# Altium schematic sheet ESP.SchDoc: Lab. Proj. PCB
size A4; Author: Tomasz Machnik; Revision: 1; SheetNumber: 4; SheetTotal: 7
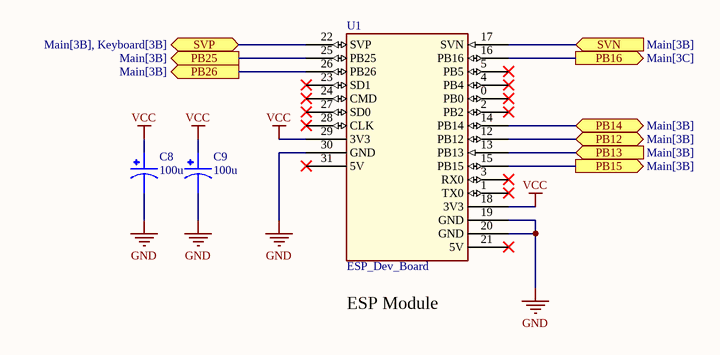
[diagram p0: ESP.SchDoc]

## Parts
C8  100u  [CAPPRD500W60D1330H2700]
C9  100u  [CAPPRD500W60D1330H2700]
U1  ESP_Dev_Board  [ESP_Dev_Board]

## Ports
PB12 (bidir, see Main[3B]), PB13 (in, see Main[3B]), PB14 (bidir, see Main[3B]), PB15 (out, see Main[3B]), PB16 (out, see Main[3C]), PB25 (out, see Main[3B]), PB26 (out, see Main[3B]), SVN (in, see Main[3B]), SVP (bidir, see Main[3B], Keyboard[3B])

## Nets
GND: C8.2 C9.2 U1.19(GND) U1.20(GND) U1.30(GND)
VCC: C8.1 C9.1 U1.18(3V3) U1.29(3V3)
PB12: U1.12(PB12) ; port PB12
PB13: U1.13(PB13) ; port PB13
PB14: U1.14(PB14) ; port PB14
PB15: U1.15(PB15) ; port PB15
PB16: U1.16(PB16) ; port PB16
PB25: U1.25(PB25) ; port PB25
PB26: U1.26(PB26) ; port PB26
SVN: U1.17(SVN) ; port SVN
SVP: U1.22(SVP) ; port SVP

Not connected (* = marked no-connect by the designer): U1 0(PB0)* 1(TX0)* 2(PB2)* 3(RX0)* 4(PB4)* 5(PB5)* 21(5V)* 23(SD1)* 24(CMD)* 27(SD0)* 28(CLK)* 31(5V)*

## Notes on the sheet
- (near U1) ESP Module
- Title:
- Author:
- Approved:
- Size:
- Date:
- Git Hash:
- A4
- Prj:
- SW Version:
- Variant:
- Edited:
- CONFIDENTIAL
- File:

## Library data of the parts
C8 C9 = 478CKS010M: 4700 ÂµF 10 V Aluminum Electrolytic Capacitors Radial, Can 98.8mOhm @ 120Hz 2000 Hrs @ 85Â°C; MF: Illinois Capacitor; SnapEDA_Link: https://www.snapeda.com/parts/478CKS010M/Illinois+Capacitor/view-part/?ref=snap; Package: Radial Illinois Capacitor; Value: *; MP: 478CKS010M; Check_prices: https://www.snapeda.com/parts/478CKS010M/Illinois+Capacitor/view-part/?ref=eda
U1 = ESP_Dev_Board: ESP Dev Board with lcd